# Altium schematic sheet portaDAC.SchDoc: portaDAC
size A0; Author: Alexander Cafarella; DocumentNumber: 1; SheetNumber: 1; SheetTotal: 1
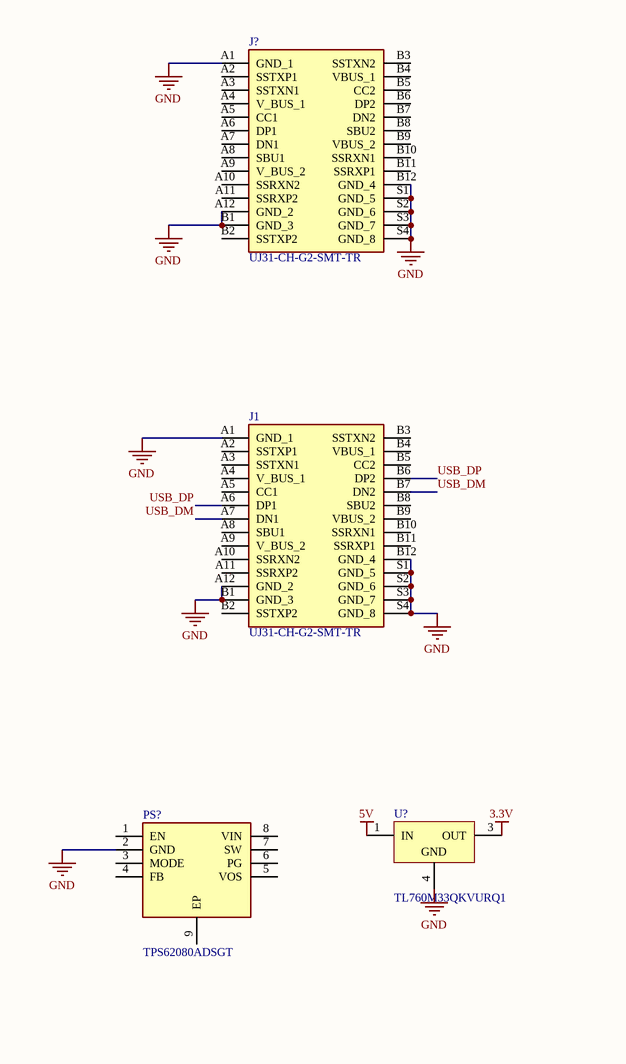
[diagram p0: portaDAC.SchDoc, top left]
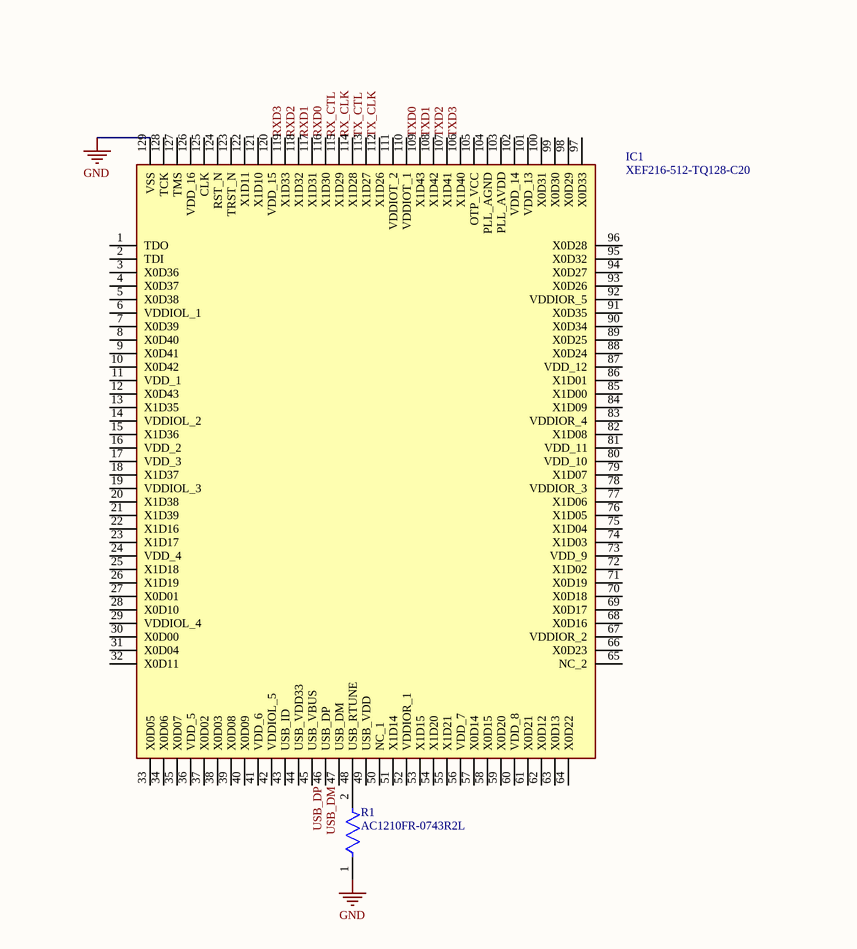
[diagram p1: portaDAC.SchDoc, top middle]
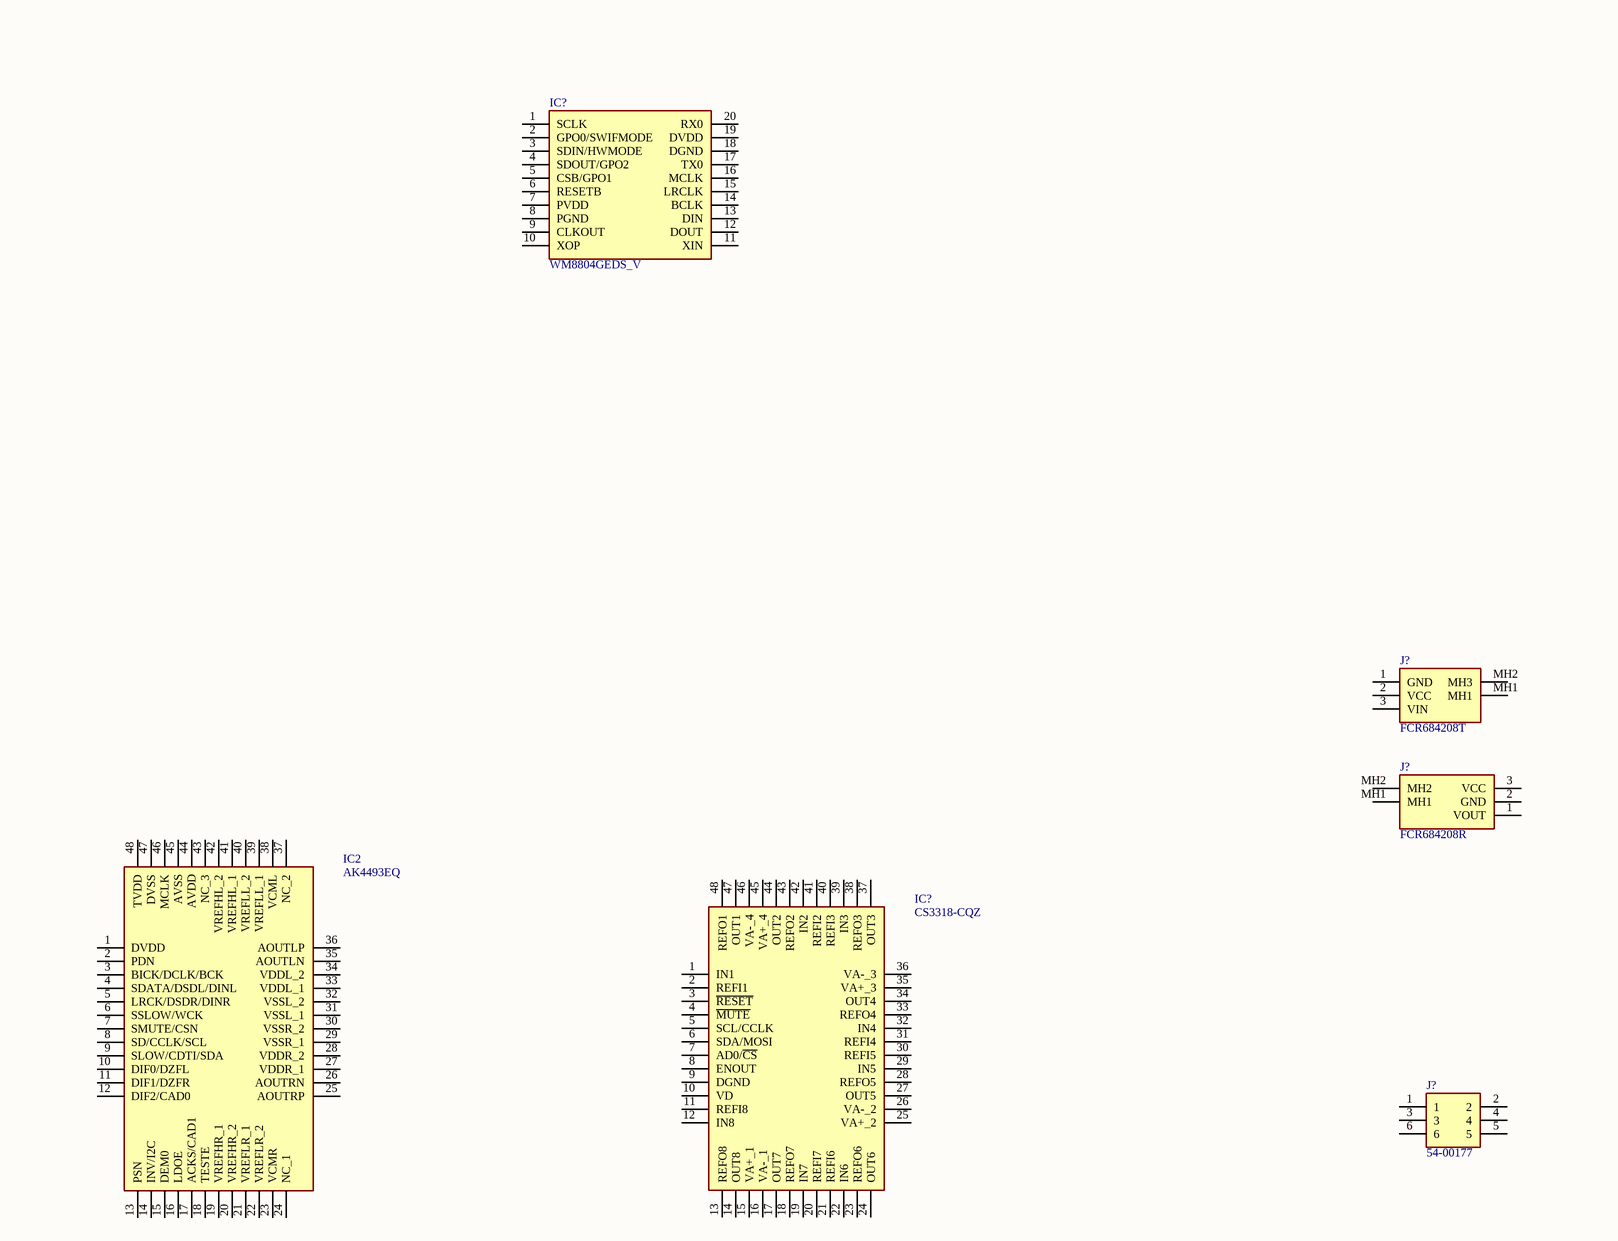
[diagram p2: portaDAC.SchDoc, top right]
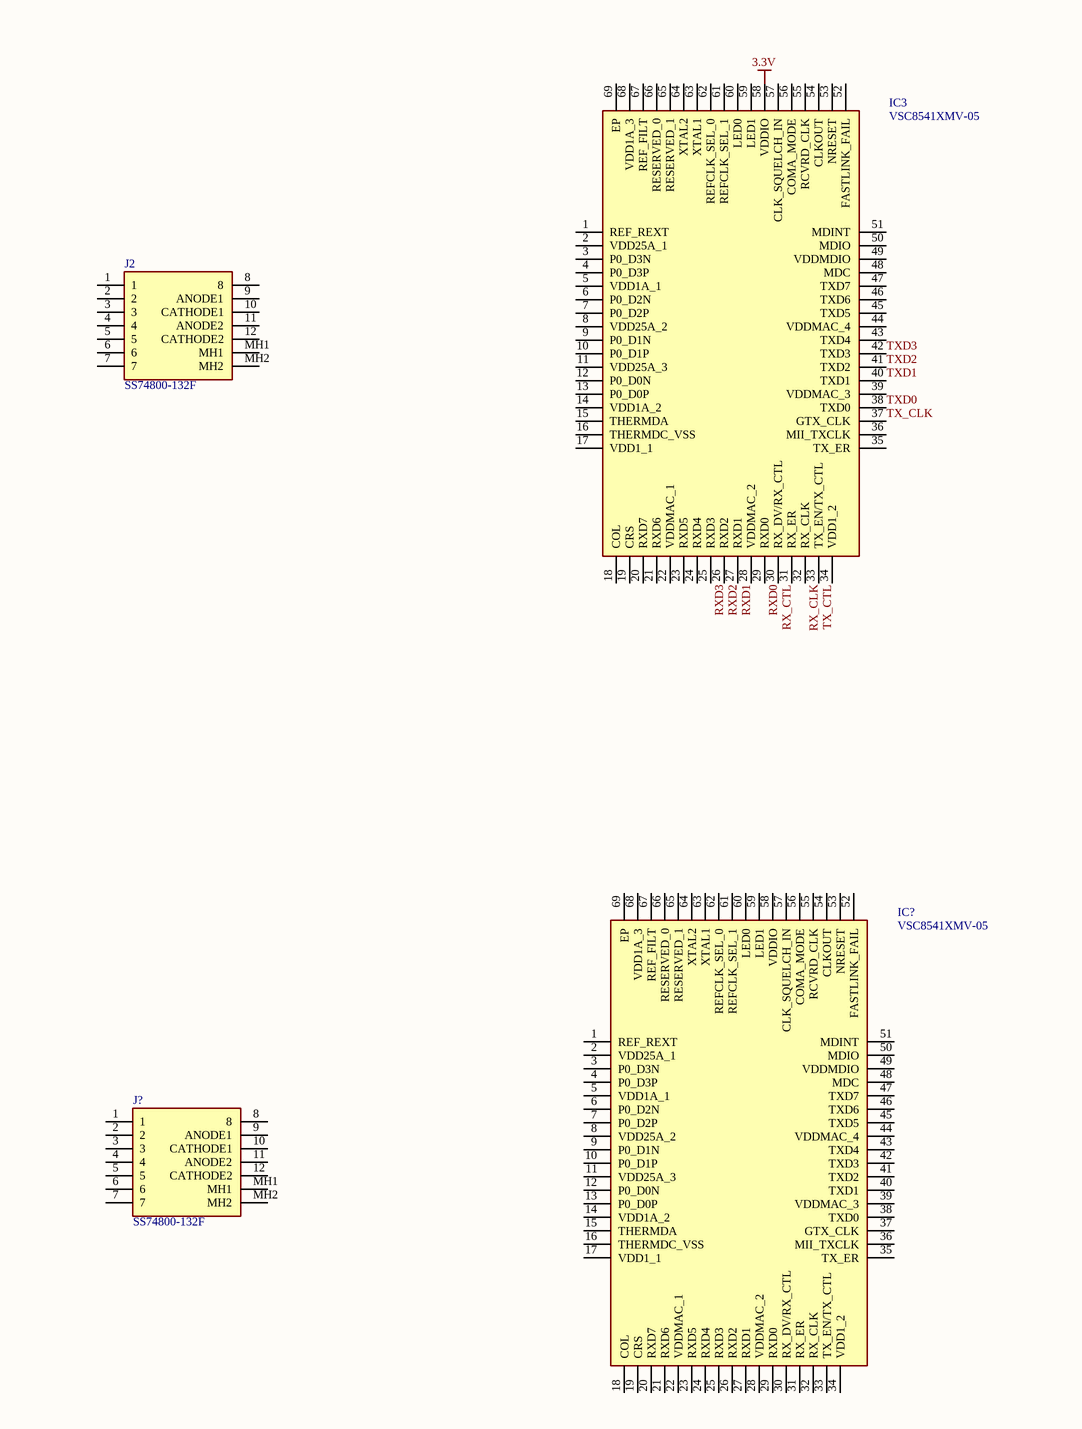
[diagram p3: portaDAC.SchDoc, bottom left]
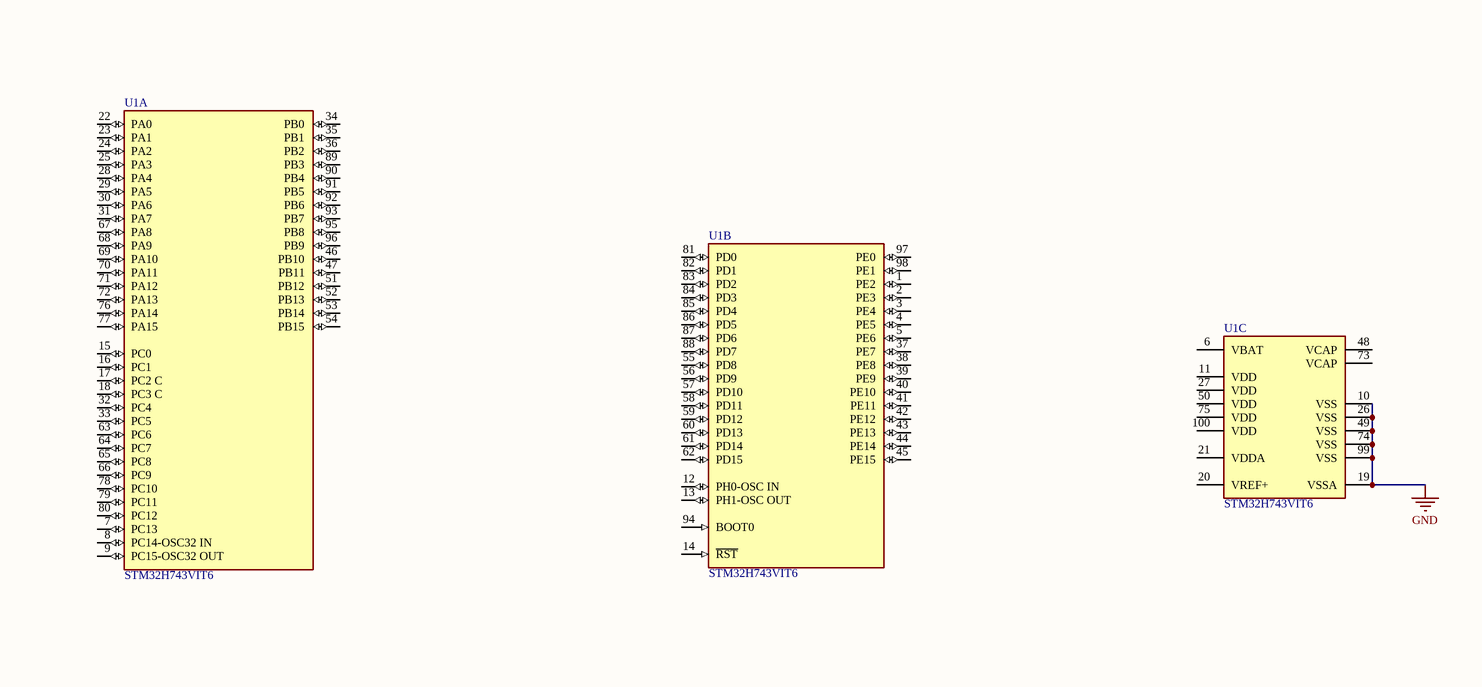
[diagram p4: portaDAC.SchDoc, bottom middle]
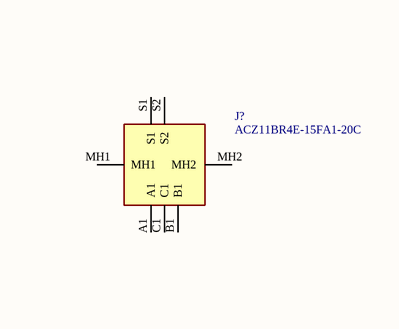
[diagram p5: portaDAC.SchDoc, bottom right]

## Parts
(Parts that share a designator on the sheet are numbered #1, #2 ... from top to bottom, then left to right.)
IC1  XEF216-512-TQ128-C20  [QFP40P1600X1600X120-129N]
IC2  AK4493EQ  [QFP50P900X900X160-48N]
IC3  VSC8541XMV-05  [QFN40P800X800X90-69N-D]
IC?#1  WM8804GEDS_V  [SOP65P780X200-20N]
IC?#2  CS3318-CQZ  [QFP50P900X900X160-48N]
IC?#3  VSC8541XMV-05  [QFN40P800X800X90-69N-D]
J1  UJ31-CH-G2-SMT-TR  [UJ31CHG2SMTTR]
J2  SS74800-132F  [SS74800132F]
J?#1  UJ31-CH-G2-SMT-TR  [UJ31CHG2SMTTR]
J?#2  FCR684208T  [FCR684208T]
J?#3  FCR684208R  [FCR684208R]
J?#4  54-00177  [5400177]
J?#5  ACZ11BR4E-15FA1-20C  [ACZ11BR4E15FA120C]
J?#6  SS74800-132F  [SS74800132F]
PS?  TPS62080ADSGT  [SON50P200X200X80-9N]
R1  AC1210FR-0743R2L  [FP-AC1210-MFG]
U1  STM32H743VIT6  [FP-LQFP100-1L-MFG]  (parts A,B,C of 3)
U?  TL760M33QKVURQ1  [KVU0003A_M]

## Nets
3.3V: IC3.58(VDDIO) U?.3(OUT)
5V: U?.1(IN)
GND: IC1.129(VSS) J1.A1(GND_1) J1.A12(GND_2) J1.B1(GND_3) J1.B12(GND_4) J1.S1(GND_5) J1.S2(GND_6) J1.S3(GND_7) J1.S4(GND_8) J?#1.A1(GND_1) J?#1.A12(GND_2) J?#1.B1(GND_3) J?#1.B12(GND_4) J?#1.S1(GND_5) J?#1.S2(GND_6) J?#1.S3(GND_7) J?#1.S4(GND_8) PS?.2(GND) R1.1 U1.10(VSS) U1.19(VSSA) U1.26(VSS) U1.49(VSS) U1.74(VSS) U1.99(VSS) U?.4(GND)
RX_CLK: IC1.114(X1D28) IC3.32(RX_CLK)
RX_CTL: IC1.115(X1D29) IC3.30(RX_DV/RX_CTL)
RXD0: IC1.116(X1D30) IC3.29(RXD0)
RXD1: IC1.117(X1D31) IC3.27(RXD1)
RXD2: IC1.118(X1D32) IC3.26(RXD2)
RXD3: IC1.119(X1D33) IC3.25(RXD3)
TX_CLK: IC1.112(X1D26) IC3.37(GTX_CLK)
TX_CTL: IC1.113(X1D27) IC3.33(TX_EN/TX_CTL)
TXD0: IC1.109(X1D43) IC3.38(TXD0)
TXD1: IC1.108(X1D42) IC3.40(TXD1)
TXD2: IC1.107(X1D41) IC3.41(TXD2)
TXD3: IC1.106(X1D40) IC3.42(TXD3)
USB_DM: IC1.47(USB_DM) J1.A7(DN1) J1.B7(DN2)
USB_DP: IC1.46(USB_DP) J1.A6(DP1) J1.B6(DP2)
NetIC1_48: IC1.48(USB_RTUNE) R1.2

Not connected (* = marked no-connect by the designer): IC1 1(TDO) 2(TDI) 3(X0D36) 4(X0D37) 5(X0D38) 6(VDDIOL_1) 7(X0D39) 8(X0D40) 9(X0D41) 10(X0D42) 11(VDD_1) 12(X0D43) 13(X1D35) 14(VDDIOL_2) 15(X1D36) 16(VDD_2) 17(VDD_3) 18(X1D37) 19(VDDIOL_3) 20(X1D38) 21(X1D39) 22(X1D16) 23(X1D17) 24(VDD_4) 25(X1D18) 26(X1D19) 27(X0D01) 28(X0D10) 29(VDDIOL_4) 30(X0D00) 31(X0D04) 32(X0D11) 33(X0D05) 34(X0D06) 35(X0D07) 36(VDD_5) 37(X0D02) 38(X0D03) 39(X0D08) 40(X0D09) 41(VDD_6) 42(VDDIOL_5) 43(USB_ID) 44(USB_VDD33) 45(USB_VBUS) 49(USB_VDD) 50(NC_1) 51(X1D14) 52(VDDIOR_1) 53(X1D15) 54(X1D20) 55(X1D21) 56(VDD_7) 57(X0D14) 58(X0D15) 59(X0D20) 60(VDD_8) 61(X0D21) 62(X0D12) 63(X0D13) 64(X0D22) 65(NC_2) 66(X0D23) 67(VDDIOR_2) 68(X0D16) 69(X0D17) 70(X0D18) 71(X0D19) 72(X1D02) 73(VDD_9) 74(X1D03) 75(X1D04) 76(X1D05) 77(X1D06) 78(VDDIOR_3) 79(X1D07) 80(VDD_10) 81(VDD_11) 82(X1D08) 83(VDDIOR_4) 84(X1D09) 85(X1D00) 86(X1D01) 87(VDD_12) 88(X0D24) 89(X0D25) 90(X0D34) 91(X0D35) 92(VDDIOR_5) 93(X0D26) 94(X0D27) 95(X0D32) 96(X0D28) 97(X0D33) 98(X0D29) 99(X0D30) 100(X0D31) 101(VDD_13) 102(VDD_14) 103(PLL_AVDD) 104(PLL_AGND) 105(OTP_VCC) 110(VDDIOT_1) 111(VDDIOT_2) 120(VDD_15) 121(X1D10) 122(X1D11) 123(TRST_N) 124(RST_N) 125(CLK) 126(VDD_16) 127(TMS) 128(TCK); IC2 1(DVDD) 2(PDN) 3(BICK/DCLK/BCK) 4(SDATA/DSDL/DINL) 5(LRCK/DSDR/DINR) 6(SSLOW/WCK) 7(SMUTE/CSN) 8(SD/CCLK/SCL) 9(SLOW/CDTI/SDA) 10(DIF0/DZFL) 11(DIF1/DZFR) 12(DIF2/CAD0) 13(PSN) 14(INV/I2C) 15(DEM0) 16(LDOE) 17(ACKS/CAD1) 18(TESTE) 19(VREFHR_1) 20(VREFHR_2) 21(VREFLR_1) 22(VREFLR_2) 23(VCMR) 24(NC_1) 25(AOUTRP) 26(AOUTRN) 27(VDDR_1) 28(VDDR_2) 29(VSSR_1) 30(VSSR_2) 31(VSSL_1) 32(VSSL_2) 33(VDDL_1) 34(VDDL_2) 35(AOUTLN) 36(AOUTLP) 37(NC_2) 38(VCML) 39(VREFLL_1) 40(VREFLL_2) 41(VREFHL_1) 42(VREFHL_2) 43(NC_3) 44(AVDD) 45(AVSS) 46(MCLK) 47(DVSS) 48(TVDD); IC3 1(REF_REXT) 2(VDD25A_1) 3(P0_D3N) 4(P0_D3P) 5(VDD1A_1) 6(P0_D2N) 7(P0_D2P) 8(VDD25A_2) 9(P0_D1N) 10(P0_D1P) 11(VDD25A_3) 12(P0_D0N) 13(P0_D0P) 14(VDD1A_2) 15(THERMDA) 16(THERMDC_VSS) 17(VDD1_1) 18(COL) 19(CRS) 20(RXD7) 21(RXD6) 22(VDDMAC_1) 23(RXD5) 24(RXD4) 28(VDDMAC_2) 31(RX_ER) 34(VDD1_2) 35(TX_ER) 36(MII_TXCLK) 39(VDDMAC_3) 43(TXD4) 44(VDDMAC_4) 45(TXD5) 46(TXD6) 47(TXD7) 48(MDC) 49(VDDMDIO) 50(MDIO) 51(MDINT) 52(FASTLINK_FAIL) 53(NRESET) 54(CLKOUT) 55(RCVRD_CLK) 56(COMA_MODE) 57(CLK_SQUELCH_IN) 59(LED1) 60(LED0) 61(REFCLK_SEL_1) 62(REFCLK_SEL_0) 63(XTAL1) 64(XTAL2) 65(RESERVED_1) 66(RESERVED_0) 67(REF_FILT) 68(VDD1A_3) 69(EP); IC?#1 1(SCLK) 2(GPO0/SWIFMODE) 3(SDIN/HWMODE) 4(SDOUT/GPO2) 5(CSB/GPO1) 6(RESETB) 7(PVDD) 8(PGND) 9(CLKOUT) 10(XOP) 11(XIN) 12(DOUT) 13(DIN) 14(BCLK) 15(LRCLK) 16(MCLK) 17(TX0) 18(DGND) 19(DVDD) 20(RX0); IC?#2 1(IN1) 2(REFI1) 3(~{RESET}) 4(~{MUTE}) 5(SCL/CCLK) 6(SDA/MOSI) 7(AD0/~{CS}) 8(ENOUT) 9(DGND) 10(VD) 11(REFI8) 12(IN8) 13(REFO8) 14(OUT8) 15(VA+_1) 16(VA-_1) 17(OUT7) 18(REFO7) 19(IN7) 20(REFI7) 21(REFI6) 22(IN6) 23(REFO6) 24(OUT6) 25(VA+_2) 26(VA-_2) 27(OUT5) 28(REFO5) 29(IN5) 30(REFI5) 31(REFI4) 32(IN4) 33(REFO4) 34(OUT4) 35(VA+_3) 36(VA-_3) 37(OUT3) 38(REFO3) 39(IN3) 40(REFI3) 41(REFI2) 42(IN2) 43(REFO2) 44(OUT2) 45(VA+_4) 46(VA-_4) 47(OUT1) 48(REFO1); IC?#3 1(REF_REXT) 2(VDD25A_1) 3(P0_D3N) 4(P0_D3P) 5(VDD1A_1) 6(P0_D2N) 7(P0_D2P) 8(VDD25A_2) 9(P0_D1N) 10(P0_D1P) 11(VDD25A_3) 12(P0_D0N) 13(P0_D0P) 14(VDD1A_2) 15(THERMDA) 16(THERMDC_VSS) 17(VDD1_1) 18(COL) 19(CRS) 20(RXD7) 21(RXD6) 22(VDDMAC_1) 23(RXD5) 24(RXD4) 25(RXD3) 26(RXD2) 27(RXD1) 28(VDDMAC_2) 29(RXD0) 30(RX_DV/RX_CTL) 31(RX_ER) 32(RX_CLK) 33(TX_EN/TX_CTL) 34(VDD1_2) 35(TX_ER) 36(MII_TXCLK) 37(GTX_CLK) 38(TXD0) 39(VDDMAC_3) 40(TXD1) 41(TXD2) 42(TXD3) 43(TXD4) 44(VDDMAC_4) 45(TXD5) 46(TXD6) 47(TXD7) 48(MDC) 49(VDDMDIO) 50(MDIO) 51(MDINT) 52(FASTLINK_FAIL) 53(NRESET) 54(CLKOUT) 55(RCVRD_CLK) 56(COMA_MODE) 57(CLK_SQUELCH_IN) 58(VDDIO) 59(LED1) 60(LED0) 61(REFCLK_SEL_1) 62(REFCLK_SEL_0) 63(XTAL1) 64(XTAL2) 65(RESERVED_1) 66(RESERVED_0) 67(REF_FILT) 68(VDD1A_3) 69(EP); J1 A2(SSTXP1) A3(SSTXN1) A4(V_BUS_1) A5(CC1) A8(SBU1) A9(V_BUS_2) A10(SSRXN2) A11(SSRXP2) B2(SSTXP2) B3(SSTXN2) B4(VBUS_1) B5(CC2) B8(SBU2) B9(VBUS_2) B10(SSRXN1) B11(SSRXP1); J2 1 2 3 4 5 6 7 8 9(ANODE1) 10(CATHODE1) 11(ANODE2) 12(CATHODE2) MH1 MH2; J?#1 A2(SSTXP1) A3(SSTXN1) A4(V_BUS_1) A5(CC1) A6(DP1) A7(DN1) A8(SBU1) A9(V_BUS_2) A10(SSRXN2) A11(SSRXP2) B2(SSTXP2) B3(SSTXN2) B4(VBUS_1) B5(CC2) B6(DP2) B7(DN2) B8(SBU2) B9(VBUS_2) B10(SSRXN1) B11(SSRXP1); J?#2 1(GND) 2(VCC) 3(VIN) MH1 MH2(MH3); J?#3 1(VOUT) 2(GND) 3(VCC) MH1 MH2; J?#4 1 2 3 4 5 6; J?#5 A1 B1 C1 MH1 MH2 S1 S2; J?#6 1 2 3 4 5 6 7 8 9(ANODE1) 10(CATHODE1) 11(ANODE2) 12(CATHODE2) MH1 MH2; PS? 1(EN) 3(MODE) 4(FB) 5(VOS) 6(PG) 7(SW) 8(VIN) 9(EP); U1 1(PE2) 2(PE3) 3(PE4) 4(PE5) 5(PE6) 6(VBAT) 7(PC13) 8(PC14-OSC32_IN) 9(PC15-OSC32_OUT) 11(VDD) 12(PH0-OSC_IN) 13(PH1-OSC_OUT) 14(~{RST}) 15(PC0) 16(PC1) 17(PC2_C) 18(PC3_C) 20(VREF+) 21(VDDA) 22(PA0) 23(PA1) 24(PA2) 25(PA3) 27(VDD) 28(PA4) 29(PA5) 30(PA6) 31(PA7) 32(PC4) 33(PC5) 34(PB0) 35(PB1) 36(PB2) 37(PE7) 38(PE8) 39(PE9) 40(PE10) 41(PE11) 42(PE12) 43(PE13) 44(PE14) 45(PE15) 46(PB10) 47(PB11) 48(VCAP) 50(VDD) 51(PB12) 52(PB13) 53(PB14) 54(PB15) 55(PD8) 56(PD9) 57(PD10) 58(PD11) 59(PD12) 60(PD13) 61(PD14) 62(PD15) 63(PC6) 64(PC7) 65(PC8) 66(PC9) 67(PA8) 68(PA9) 69(PA10) 70(PA11) 71(PA12) 72(PA13) 73(VCAP) 75(VDD) 76(PA14) 77(PA15) 78(PC10) 79(PC11) 80(PC12) 81(PD0) 82(PD1) 83(PD2) 84(PD3) 85(PD4) 86(PD5) 87(PD6) 88(PD7) 89(PB3) 90(PB4) 91(PB5) 92(PB6) 93(PB7) 94(BOOT0) 95(PB8) 96(PB9) 97(PE0) 98(PE1) 100(VDD)

## Library data of the parts
IC1 = XEF216-512-TQ128-C20: Integrated Circuit; Manufacturer_Name: XMOS; Datasheet Link: https://download.xmos.com/XM-007543-PC-10.pdf; Height: 1.2mm; Manufacturer_Part_Number: XEF216-512-TQ128-C20
IC2 = AK4493EQ: Integrated Circuit; Manufacturer_Name: AKM; Datasheet Link: http://d.zaix.ru/5cHC.pdf; Height: 1.6mm; Manufacturer_Part_Number: AK4493EQ; Arrow Part Number: AK4493EQ; Arrow Price/Stock: https://www.arrow.com/en/products/ak4493eq/asahi-kasei-microdevices-corporation
IC3 IC?#3 = VSC8541XMV-02: Integrated Circuit; Manufacturer_Name: Microsemi Corporation; Datasheet Link: https://ww1.microchip.com/downloads/en/DeviceDoc/VMDS-10513_VSC8541-02_VSC8541-05_Datasheet.pdf; Height: 0.9mm; Manufacturer_Part_Number: VSC8541XMV-05; Mouser Part Number: 494-VSC8541XMV-05; Mouser Price/Stock: https://www.mouser.com/ProductDetail/Microchip-Microsemi/VSC8541XMV-05?qs=byeeYqUIh0PEaQa1Vsi88A==
IC?#1 = WM8804GEDS_V: Integrated Circuit; Manufacturer_Name: Cirrus Logic; Manufacturer_Part_Number: WM8804GEDS/V; Datasheet Link: https://componentsearchengine.com/Datasheets/1/WM8804GEDS_V.pdf; Height: 2mm; Mouser Part Number: 238-WM8804GEDS/V; Mouser Price/Stock: https://www.mouser.co.uk/ProductDetail/Cirrus-Logic/WM8804GEDS-V?qs=%2F%252BPMR94VuMZfaZi2DDhEQA%3D%3D
IC?#2 = CS3318-CQZ: Integrated Circuit; Manufacturer_Name: Cirrus Logic; Datasheet Link: https://www.mouser.com/ds/2/76/CS3318_F1-1142113.pdf; Height: 1.6mm; Manufacturer_Part_Number: CS3318-CQZ; Mouser Part Number: 777-CS3318-CQZ; Mouser Price/Stock: https://www.mouser.com/Search/Refine.aspx?Keyword=777-CS3318-CQZ
J1 J?#1 = UJ31-CH-G2-SMT-TR: Connector; Manufacturer_Name: CUI Inc.; Datasheet Link: https://www.arrow.com/en/products/uj31-ch-g2-smt-tr/cui-devices; Height: 4.66mm; Manufacturer_Part_Number: UJ31-CH-G2-SMT-TR; Mouser Part Number: 490-UJ31-CH-G2SMT-TR; Mouser Price/Stock: https://www.mouser.co.uk/ProductDetail/CUI-Devices/UJ31-CH-G2-SMT-TR?qs=W0yvOO0ixfGEsh2EYrPgIQ%3D%3D; Arrow Part Number: UJ31-CH-G2-SMT-TR; Arrow Price/Stock: https://www.arrow.com/en/products/uj31-ch-g2-smt-tr/cui-devices
J2 J?#6 = SS74800-132F: Connector; Manufacturer_Name: Stewart Connector; Datasheet Link: https://www.belfuse.com/resources/drawings/stewartconnector/dr-stw-ss74800-132f.pdf; Height: 15.21mm; Manufacturer_Part_Number: SS74800-132F; Mouser Part Number: 530-SS74800-132F; Mouser Price/Stock: https://www.mouser.co.uk/ProductDetail/Stewart-Connector-Bel/SS74800-132F?qs=PzGy0jfpSMs%2Fug1%2FiHZ8KQ%3D%3D; Arrow Part Number: SS74800-132F; Arrow Price/Stock: https://www.arrow.com/en/products/ss74800-132f/bel-group
J?#2 = FCR684208T: Connector; Manufacturer_Name: CLIFF ELECTRONIC COMPONENTS; Datasheet Link: https://www.cliffuk.co.uk/products/optical/FCR684208T.pdf; Height: 10.2mm; Manufacturer_Part_Number: FCR684208T
J?#3 = FCR684208R: Connector; Manufacturer_Name: CLIFF ELECTRONIC COMPONENTS; Datasheet Link: https://www.cliffuk.co.uk/products/optical/FCR684208R.pdf; Height: 10.2mm; Manufacturer_Part_Number: FCR684208R
J?#4 = 54-00177: Connector; Manufacturer_Name: Tensility International Corp; Datasheet Link: https://tensility.s3-us-west-2.amazonaws.com/uploads/product_doc/document/4373/54-00177.pdf; Height: 5.5mm; Manufacturer_Part_Number: 54-00177
J?#5 = ACZ11BR4E-15FA1-20C: Connector; Manufacturer_Name: CUI Inc.; Datasheet Link: https://www.cuidevices.com/product/resource/acz11.pdf; Height: 13.75mm; Manufacturer_Part_Number: ACZ11BR4E-15FA1-20C; Mouser Part Number: 490-ACZ11E15FA120C; Mouser Price/Stock: https://www.mouser.co.uk/ProductDetail/CUI-Devices/ACZ11BR4E-15FA1-20C?qs=WyjlAZoYn521vRzc3WQA5g%3D%3D; Arrow Part Number: ACZ11BR4E-15FA1-20C; Arrow Price/Stock: https://www.arrow.com/en/products/acz11br4e-15fa1-20c/cui-devices
PS? = TPS62080ADSGT: Power Supply; Manufacturer_Name: Texas Instruments; Datasheet Link: http://www.ti.com/lit/ds/symlink/tps62080a.pdf; Height: 0.8mm; Manufacturer_Part_Number: TPS62080ADSGT; Mouser Part Number: 595-TPS62080ADSGT; Mouser Price/Stock: https://www.mouser.co.uk/ProductDetail/Texas-Instruments/TPS62080ADSGT/?qs=2UFnnMkojnWccreyVlyiGQ%3D%3D; Arrow Part Number: TPS62080ADSGT; Arrow Price/Stock: https://www.arrow.com/en/products/tps62080adsgt/texas-instruments
R1 = CMP-03412-022328-1: RES SMD 43.2 OHM 1% 1/2W 1210; Manufacturer: Yageo; Resistance: 43.2Ω; Power Rating: 0.5W; Automotive Grade: Grade 0; Value: 43.2Ω; Tolerance: 0.01; Voltage Rating: 200V; Device Class L1: Passive Components; RoHS: TRUE; Temperature: -55°C to +155°C; Temperature Range Low: -55°C; Temperature Range High: +155°C; Digikey Description: RES SMD 43.2 OHM 1% 1/2W 1210; Category: Res; Device Class L2: Resistors; Ipc Land Pattern Name: RESC310260X55; Series: AC; Package: AC1210; Footprint Url: http://www.yageo.com/exep/pages/download/literatures/PYu-R_Mount_9.pdf; ComponentLink2URL: http://www.yageo.com/NewPortal/yageodocoutput?fileName=/pdf/R-Chip/PYu-AC_51_RoHS_L_6.pdf; Composition: Thick Film; Octopart: https://octopart.com/ac1210fr-0743r2l-yageo-71368660; Lead Free: Yes; Automotive: Yes; ComponentLink2Description: Datasheet; Device Class L3: Chip SMD Resistors; Height: 0.65mm; Manufacturer Part Number: AC1210FR-0743R2L
U1 = CMP-12105-000050-1: IC MCU 32BIT 2MB FLASH 100LQFP; Manufacturer: STMicroelectronics; Number Of Ethernet Channels: 1; Number Of Usb Channels: 2; Number Of A/D Converters: 3; Min Supply Voltage: 1.71V; Ram Size: 1060KBytes; Number Of I2C Channels: 4; Frequency: 480MHz; Number Of Adc Channels: 36; Number Of I/Os: 82; Max Supply Voltage: 3.6V; Number Of Spi Channels: 6; Memory Size: 2MBytes; Max Junction Temp: +125°C; Core Architecture: Arm Cortex-M7; Interface: I2C,SPI,UART,USART,USB,LIN,IrDA,Ethernet,I2S,Other; Number Of Timers/Counters: 20; Data Bus Width: 32bits; Number Of Pwm Channels: 42; Number Of Uart Channels: 9; Standoff Height: 0.05mm; Device Class L1: Integrated Circuits (ICs); ComponentLink2URL: https://www.st.com/resource/en/datasheet/stm32h743vi.pdf; Automotive: No; Memory Type: FLASH; Number Of Cores: 1; Temperature Range Low: -40°C; RoHS: TRUE; Ambient Temperature Range Low: -40°C; ComponentLink2Description: Datasheet; Device Class L2: Embedded Processors and Controllers; Device Class L3: Microcontrollers; Digikey Description: IC MCU 32BIT 2MB FLASH 100LQFP; Temperature Range High: +125°C; Ambient Temperature Range High: +85°C; Package: LQFP100-1L; Temperature: -40°C to +125°C; Category: IC; Ipc Land Pattern Name: QFP50P1600X1600X160-100; Height: 1.6mm; Manufacturer Part Number: STM32H743VIT6; Octopart: https://octopart.com/stm32h743vit6-stmicroelectronics-76372527; Lead Free: Yes
U? = CMP-0395-01069-2: Single Output Automotive LDO, 500 mA, Fixed 3.3 V Output, 3.8 to 26 V Input, 3-pin PFM (KVU), -40 to 125 degC, Green (RoHS & no Sb/Br); Manufacturer: Texas Instruments; Vout Adj(Max)(V): 3.3; Iout(Max)(A): 0.5; Vin(Min)(V): 3.8; Vin(Max)(V): 26; Vdo(Typ)(mV): 500; Accuracy(%): 3; SubFamily: Single Channel LDO; Iq(Typ)(mA): 20; Fixed Output Options(V): 3.3; ComponentLink3URL: http://www.ti.com/litv/pdf/mpsf018c; ComponentLink2Description: Datasheet; PartNumber: TL760M33QKVURQ1; Rating: Automotive; ComponentLink2URL: http://www.ti.com/general/docs/lit/getliterature.tsp?genericPartNumber=TL760M33-Q1&fileType=pdf; Eco-Plan: Green (RoHS & no Sb/Br); ComponentLink1URL: http://www.ti.com/; Mounting Technology: Surface Mount; ComponentLink4URL: Samples URL:http://www.ti.com/product/tl760m33-q1#samples; Code_JEDEC: TO-252; ComponentLink3Description: Package Specification; PackageReference: KVU0003A; Vout Adj(Min)(V): 3.3; ComponentLink1Description: Manufacturer URL; ComponentLink4Description: URL Link1; DatasheetVersion: SGLS284I; PackageDescription: 3-Pin Plastic Flange Mount, Body 6.1 x 6.6 mm, Pitch 2.29 mm; PackageVersion: 4205521-2/D